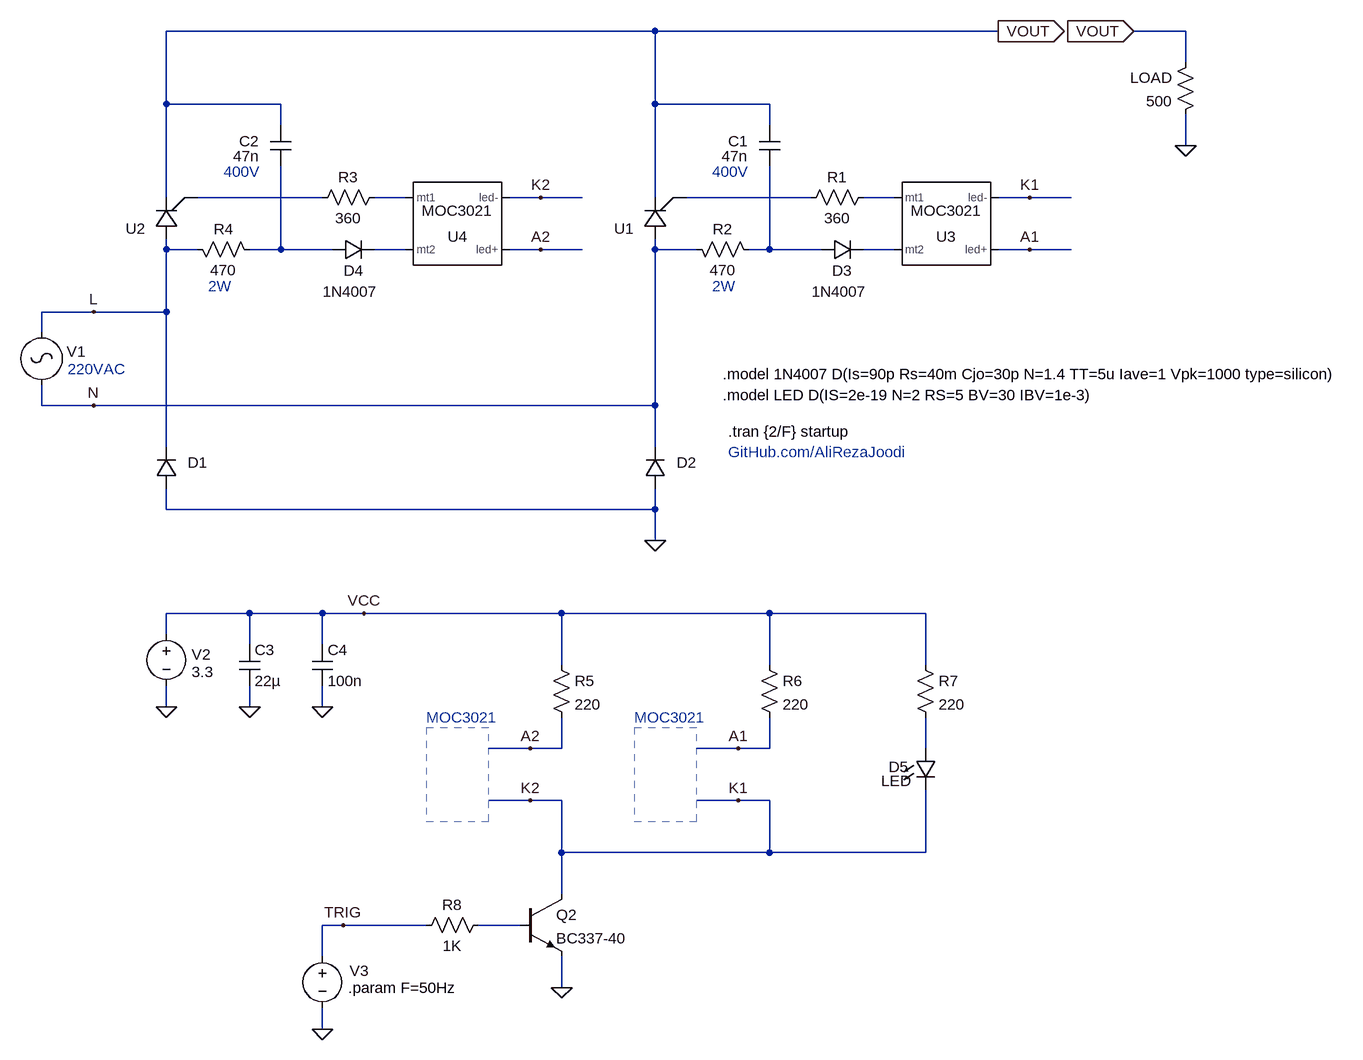
[diagram p0: schematic v2.0.asc]
v2.0.asc, the LTspice schematic file:
Version 4.1
SHEET 1 2356 1584
WIRE 960 -320 208 -320
WIRE 1488 -320 960 -320
WIRE 1776 -320 1696 -320
WIRE 1776 -272 1776 -320
WIRE 208 -208 208 -320
WIRE 384 -208 208 -208
WIRE 960 -208 960 -320
WIRE 1136 -208 960 -208
WIRE 384 -176 384 -208
WIRE 1136 -176 1136 -208
WIRE 1776 -144 1776 -192
WIRE 208 -64 208 -208
WIRE 448 -64 256 -64
WIRE 576 -64 528 -64
WIRE 784 -64 736 -64
WIRE 848 -64 784 -64
WIRE 960 -64 960 -208
WIRE 1200 -64 1008 -64
WIRE 1328 -64 1280 -64
WIRE 1536 -64 1488 -64
WIRE 1600 -64 1536 -64
WIRE 208 16 208 0
WIRE 256 16 208 16
WIRE 384 16 384 -112
WIRE 384 16 336 16
WIRE 464 16 384 16
WIRE 576 16 528 16
WIRE 784 16 736 16
WIRE 848 16 784 16
WIRE 960 16 960 0
WIRE 1024 16 960 16
WIRE 1136 16 1136 -112
WIRE 1136 16 1104 16
WIRE 1216 16 1136 16
WIRE 1328 16 1280 16
WIRE 1536 16 1488 16
WIRE 1600 16 1536 16
WIRE 96 112 16 112
WIRE 208 112 208 16
WIRE 208 112 96 112
WIRE 16 144 16 112
WIRE 16 256 16 224
WIRE 96 256 16 256
WIRE 960 256 960 16
WIRE 960 256 96 256
WIRE 208 320 208 112
WIRE 960 320 960 256
WIRE 208 416 208 384
WIRE 960 416 960 384
WIRE 960 416 208 416
WIRE 960 464 960 416
WIRE 336 576 208 576
WIRE 448 576 336 576
WIRE 512 576 448 576
WIRE 816 576 512 576
WIRE 1136 576 816 576
WIRE 1376 576 1136 576
WIRE 208 608 208 576
WIRE 336 624 336 576
WIRE 448 624 448 576
WIRE 816 656 816 576
WIRE 1136 656 1136 576
WIRE 1376 656 1376 576
WIRE 208 720 208 688
WIRE 336 720 336 688
WIRE 448 720 448 688
WIRE 768 784 704 784
WIRE 816 784 816 736
WIRE 816 784 768 784
WIRE 1088 784 1024 784
WIRE 1136 784 1136 736
WIRE 1136 784 1088 784
WIRE 1376 784 1376 736
WIRE 768 864 704 864
WIRE 816 864 768 864
WIRE 1088 864 1024 864
WIRE 1136 864 1088 864
WIRE 816 944 816 864
WIRE 1136 944 1136 864
WIRE 1136 944 816 944
WIRE 1376 944 1376 848
WIRE 1376 944 1136 944
WIRE 816 1008 816 944
WIRE 480 1056 448 1056
WIRE 608 1056 480 1056
WIRE 752 1056 688 1056
WIRE 448 1104 448 1056
WIRE 816 1152 816 1104
WIRE 448 1216 448 1184
FLAG 448 1216 0
FLAG 96 112 L
FLAG 208 720 0
FLAG 512 576 VCC
FLAG 448 720 0
FLAG 336 720 0
FLAG 960 464 0
FLAG 1696 -320 VOUT
IOPIN 1696 -320 In
FLAG 816 1152 0
FLAG 480 1056 TRIG
FLAG 1488 -320 VOUT
IOPIN 1488 -320 Out
FLAG 96 256 N
FLAG 1536 16 A1
FLAG 1536 -64 K1
FLAG 784 16 A2
FLAG 784 -64 K2
FLAG 768 784 A2
FLAG 768 864 K2
FLAG 1088 784 A1
FLAG 1088 864 K1
FLAG 1776 -144 0
SYMBOL res 1792 -288 M0
SYMATTR InstName LOAD
SYMATTR Value 500
SYMBOL res 800 640 R0
SYMATTR InstName R5
SYMATTR Value 220
SYMBOL voltage 448 1088 R0
WINDOW 3 -49 -29 Invisible 2
WINDOW 123 0 0 Left 0
WINDOW 0 42 38 Left 2
SYMATTR Value PULSE(0 3.3 4m 1n 1n 200u {1/(2*F)})
SYMATTR InstName V3
SYMATTR SpiceLine Rser=0.1
SYMBOL voltage 208 592 R0
WINDOW 0 39 47 Left 2
WINDOW 3 39 74 Left 2
WINDOW 123 0 0 Left 0
SYMATTR InstName V2
SYMATTR Value 3.3
SYMATTR SpiceLine Rser=0.1
SYMBOL LED 1360 784 R0
WINDOW 0 -41 28 Left 2
WINDOW 3 -52 50 Left 2
SYMATTR InstName D5
SYMATTR Value LED
SYMBOL res 1360 640 R0
SYMATTR InstName R7
SYMATTR Value 220
SYMBOL cap 320 624 R0
SYMATTR InstName C3
SYMATTR Value 22µ
SYMBOL cap 432 624 R0
SYMATTR InstName C4
SYMATTR Value 100n
SYMBOL MyLib\\Voltage_AC 16 128 M0
WINDOW 123 0 0 Left 0
WINDOW 3 41 64 Invisible 2
WINDOW 0 -68 45 Left 2
SYMATTR Value SINE(0 325 {F})
SYMATTR InstName V1
SYMATTR SpiceLine Rser=0.1
SYMBOL npn 752 1008 R0
SYMATTR InstName Q2
SYMATTR Value BC337-40
SYMBOL res 592 1072 R270
WINDOW 0 32 56 VTop 2
WINDOW 3 0 56 VBottom 2
SYMATTR InstName R8
SYMATTR Value 1K
SYMBOL res 1296 -80 R90
WINDOW 0 0 56 VBottom 2
WINDOW 3 32 56 VTop 2
SYMATTR InstName R1
SYMATTR Value 360
SYMBOL res 1008 0 M90
WINDOW 0 0 56 VBottom 2
WINDOW 3 32 56 VTop 2
SYMATTR InstName R2
SYMATTR Value 470
SYMATTR SpiceLine pwr=2
SYMBOL cap 1152 -112 R180
WINDOW 0 49 39 Left 2
WINDOW 3 49 16 Left 2
SYMATTR InstName C1
SYMATTR Value 47n
SYMATTR SpiceLine V=400 Rser=5m
SYMBOL MyLib\\Opto\\MOC3021 1440 0 R180
SYMATTR InstName U3
SYMBOL diode 1216 32 R270
WINDOW 0 -32 32 VTop 2
WINDOW 3 -33 27 VBottom 2
SYMATTR InstName D3
SYMATTR Value 1N4007
SYMBOL res 544 -80 R90
WINDOW 0 0 56 VBottom 2
WINDOW 3 32 56 VTop 2
SYMATTR InstName R3
SYMATTR Value 360
SYMBOL res 240 0 M90
WINDOW 0 0 56 VBottom 2
WINDOW 3 32 56 VTop 2
SYMATTR InstName R4
SYMATTR Value 470
SYMATTR SpiceLine pwr=2
SYMBOL cap 400 -112 R180
WINDOW 0 49 39 Left 2
WINDOW 3 49 16 Left 2
SYMATTR InstName C2
SYMATTR Value 47n
SYMATTR SpiceLine V=400 Rser=5m
SYMBOL MyLib\\Opto\\MOC3021 688 0 R180
SYMATTR InstName U4
SYMBOL diode 464 32 R270
WINDOW 0 -32 32 VTop 2
WINDOW 3 -33 27 VBottom 2
SYMATTR InstName D4
SYMATTR Value 1N4007
SYMBOL res 1120 640 R0
SYMATTR InstName R6
SYMATTR Value 220
SYMBOL diode 192 384 M180
WINDOW 0 49 40 Left 2
WINDOW 3 48 16 Invisible 2
SYMATTR InstName D1
SYMBOL diode 944 384 M180
WINDOW 0 49 40 Left 2
WINDOW 3 48 16 Invisible 2
SYMATTR InstName D2
SYMBOL MyLib\\Thyristor_SCR\\S8020L 224 0 R180
WINDOW 38 48 39 Invisible 2
SYMATTR InstName U2
SYMBOL MyLib\\Thyristor_SCR\\S8020L 976 0 R180
WINDOW 38 48 39 Invisible 2
SYMATTR InstName U1
TEXT 1072 296 Left 2 !.tran {2/F} startup
TEXT 1064 240 Left 2 !.model LED D(IS=2e-19 N=2 RS=5 BV=30 IBV=1e-3)
TEXT 488 1152 Left 2 !.param F=50Hz
TEXT 608 736 Left 2 ;MOC3021
TEXT 928 736 Left 2 ;MOC3021
TEXT 296 -104 Left 2 ;400V
TEXT 1048 -104 Left 2 ;400V
TEXT 56 200 Left 2 ;220VAC
TEXT 1072 328 Left 2 ;GitHub.com/AliRezaJoodi
TEXT 1064 208 Left 2 !.model 1N4007 D(Is=90p Rs=40m Cjo=30p N=1.4 TT=5u Iave=1 Vpk=1000 type=silicon)
TEXT 1048 72 Left 2 ;2W
TEXT 272 72 Left 2 ;2W
RECTANGLE Normal 608 896 704 752 2
RECTANGLE Normal 928 896 1024 752 2

The netlist it stands for:
* v2.0.asc
R§LOAD VOUT 0 500
R5 VCC A2 220
V3 TRIG 0 PULSE(0 3.3 4m 1n 1n 200u {1/(2*F)}) Rser=0.1
V2 VCC 0 3.3 Rser=0.1
D5 N009 K2 LED
R7 VCC N009 220
C3 VCC 0 22µ
C4 VCC 0 100n
V1 L N SINE(0 325 {F}) Rser=0.1
Q2 K2 N010 0 0 BC337-40
R8 TRIG N010 1K
R1 N004 N003 360
R2 N N007 470 pwr=2
C1 N007 VOUT 47n V=400 Rser=5m
X§U3 A1 K2 N008 N004 MOC3021  ; pins led+ led- mt2 mt1
D3 N007 N008 1N4007
R3 N002 N001 360
R4 L N005 470 pwr=2
C2 N005 VOUT 47n V=400 Rser=5m
X§U4 A2 K2 N006 N002 MOC3021  ; pins led+ led- mt2 mt1
D4 N005 N006 1N4007
R6 VCC A1 220
D1 0 L D
D2 0 N D
X§U2 L N001 VOUT S8020L  ; pins A G K
X§U1 N N003 VOUT S8020L  ; pins A G K
.model D D
.lib standard.dio
.model NPN NPN
.model PNP PNP
.lib standard.bjt
.tran {2/F} startup
.model LED D(IS=2e-19 N=2 RS=5 BV=30 IBV=1e-3)
.param F=50Hz
* MOC3021
* MOC3021
* 400V
* 400V
* 220VAC
* GitHub.com/AliRezaJoodi
.model 1N4007 D(Is=90p Rs=40m Cjo=30p N=1.4 TT=5u Iave=1 Vpk=1000 type=silicon)
* 2W
* 2W
.lib MOC3021.lib
.lib MyLib/Thyristor_SCR/_SCR_Littelfuse.lib
.backanno
.end